# Altium schematic sheet 02_BLOCK_DIAGRAM.SchDoc: SBC_IMX8M_BB
size A2; CompanyName: Google LLC; Engineer: Bangfei/Michael/Leo; Organization: Google LLC; Address1: 1600 Amphitheatre Parkway; Address2: Mountain View, CA 94043; DocumentNumber: 2; Revision: PVT; SheetNumber: 2; SheetTotal: 11; ProjectName: Enterprise
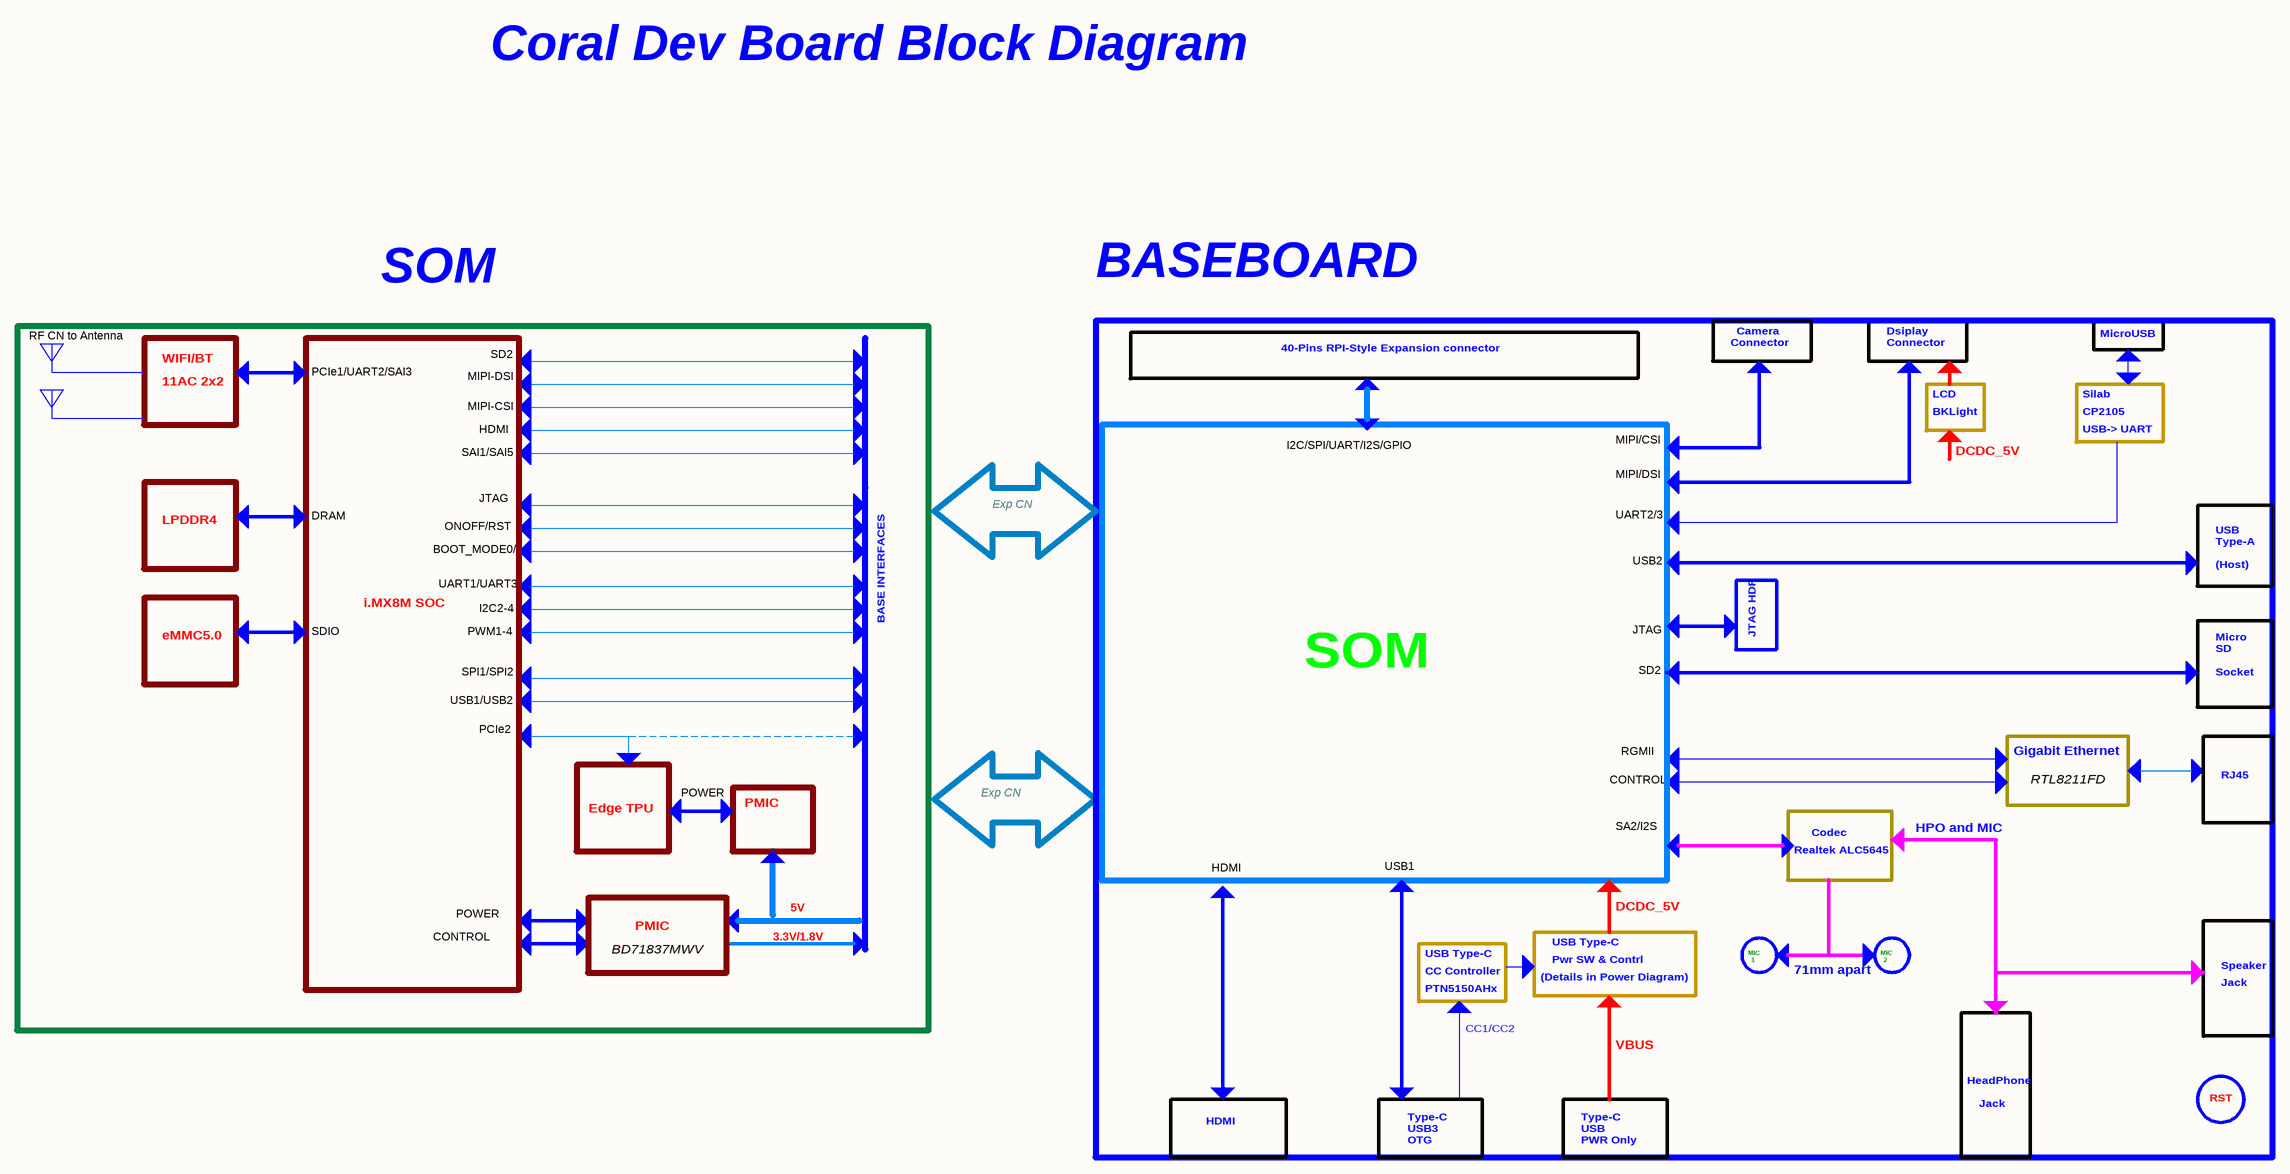
[diagram p0: 02_BLOCK_DIAGRAM.SchDoc]

## Notes on the sheet
- Coral Dev Board Block Diagram
- SOM
- BASEBOARD
- Camera
- Dsiplay
- RF CN to Antenna
- WIFI/BT
- 11AC 2x2
- PCIe1/UART2/SAI3
- MIPI-DSI
- SD2
- 40-Pins RPI-Style Expansion connector
- Connector
- MicroUSB
- MIPI-CSI
- HDMI
- I2C/SPI/UART/I2S/GPIO
- MIPI/CSI
- LCD
- BKLight
- Silab
- CP2105
- USB-> UART
- SAI1/SAI5
- JTAG
- MIPI/DSI
- DCDC_5V
- LPDDR4
- DRAM
- BOOT_MODE0/1
- ONOFF/RST
- Exp CN
- UART2/3
- USB2
- i.MX8M SOC
- UART1/UART3
- I2C2-4
- BASE INTERFACES
- USB
  Type-A
  (Host)
- eMMC5.0
- SDIO
- SPI1/SPI2
- PWM1-4
- JTAG HDR
- Micro SD
  Socket
- USB1/USB2
- PCIe2
- CONTROL
- RGMII
- Gigabit Ethernet
- RTL8211FD
- RJ45
- Edge TPU
- POWER
- PMIC
- SA2/I2S
- Codec
- HPO and MIC
- USB1
- Realtek ALC5645
- BD71837MWV
- 3.3V/1.8V
- 5V
- USB Type-C
- Pwr SW &
- Contrl
- MIC
  1
- MIC
  2
- CC Controller
- PTN5150AHx
- (Details in Power Diagram)
- 71mm apart
- Speaker
- Jack
- CC1/CC2
- VBUS
- HeadPhone
- RST
- Type-C
  USB3
  OTG
- Type-C
  USB
  PWR Only
- Project:
- Engineer:
- Date:
- File:
- Revision:
- Sheet
- of